# Altium schematic sheet Power.SchDoc
size A4; SheetNumber: 3; SheetTotal: 7
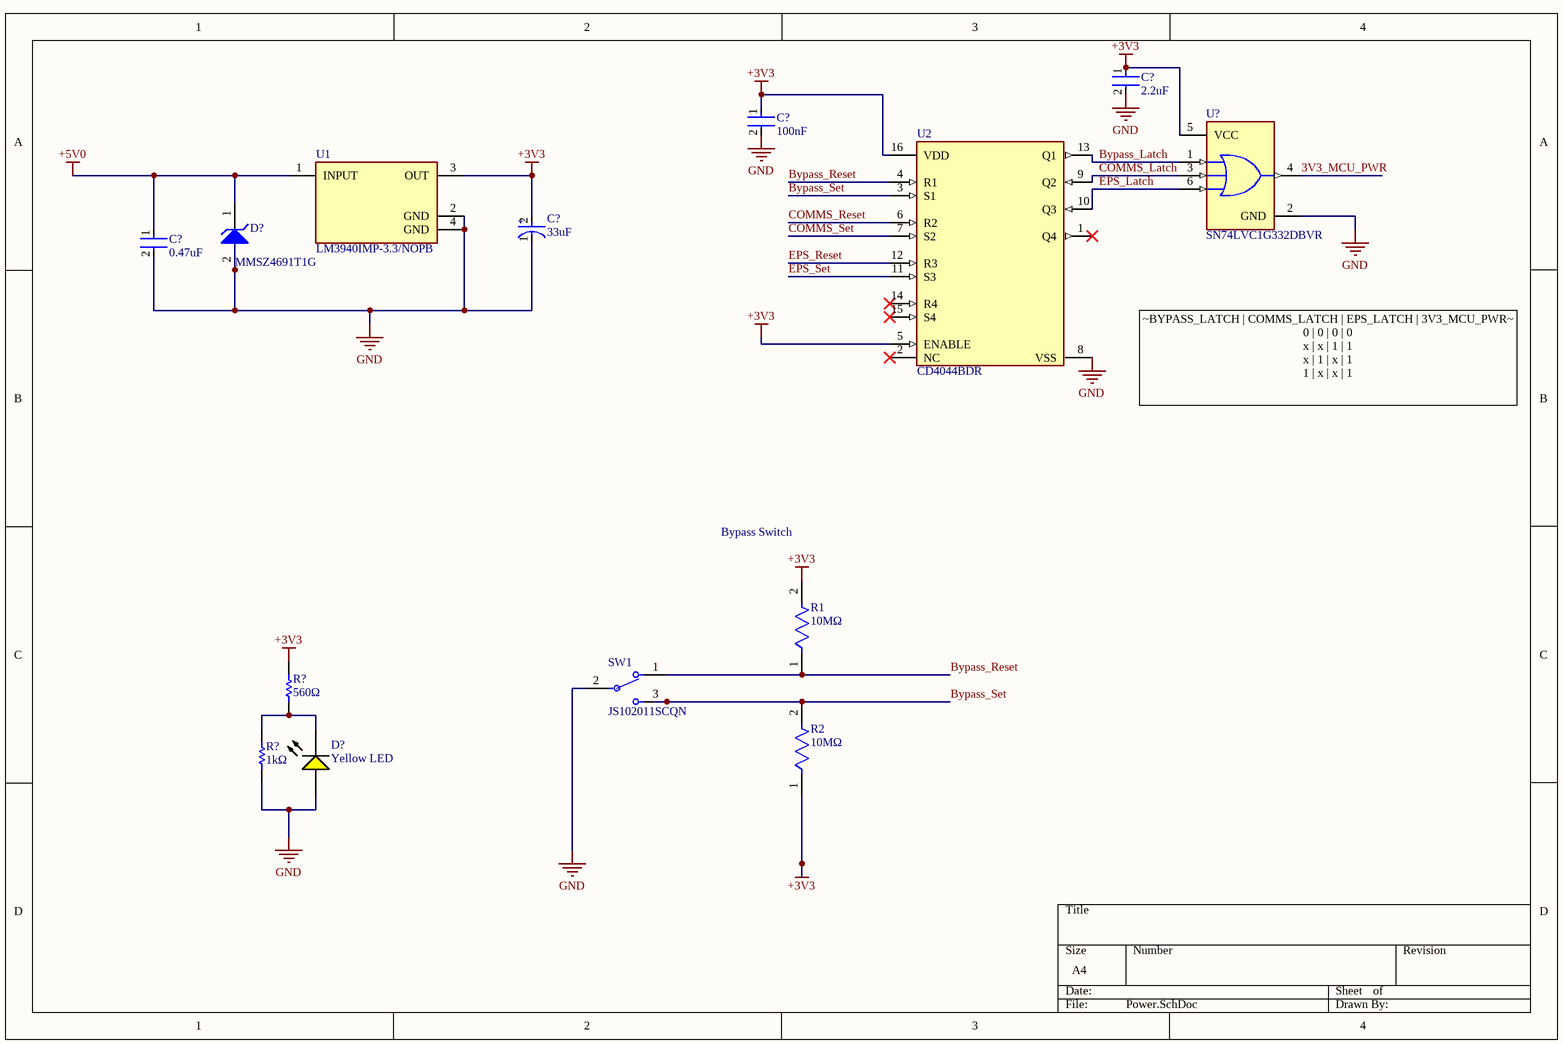
[diagram p0: Power.SchDoc]

## Parts
(Parts that share a designator on the sheet are numbered #1, #2 ... from top to bottom, then left to right.)
C?#1  2.2uF  [FP-GRM188-0_1-e0_2_0_5-MFG]
C?#2  100nF  [FP-CGA3E-0_3-0_1-IPC_A]
C?#3  33uF  [FP-TPSD-MFG]
C?#4  0.47uF  [FP-GRM188-0_1-e0_2_0_5-IPC_B]
D?#1  MMSZ4691T1G  [ONSC-SOD-123-2-425-04_V]
D?#2  Yellow LED  [AVAG-HSMX-C190_V]
R1  10MΩ  [FP-ERJ3EK-IPC_C]
R2  10MΩ  [FP-ERJ3EK-IPC_C]
R?#1  560Ω  [RESC1608X55X30ML15T15]
R?#2  1kΩ  [RESC2013X60X35ML10T20]
SW1  JS102011SCQN  [FP-JS102011SCQN-MFG]
U1  LM3940IMP-3.3/NOPB  [FP-DCY0004A-MFG]
U2  CD4044BDR  [FP-D0016A-IPC_C]
U?  SN74LVC1G332DBVR  [FP-DBV0006A-MFG]

## Nets
+3V3: C?#1.1 C?#2.1 C?#3.2(A) R1.2 R2.1 R?#1.2 U1.3(OUT) U2.5(ENABLE) U2.16(VDD) U?.5(VCC)
+5V0: C?#4.1 D?#1.1(K) U1.1(INPUT)
GND: C?#1.2 C?#2.2 C?#3.1(C) C?#4.2 D?#1.2(A) D?#2.1(A) R?#2.1 SW1.2(C) U1.2(GND) U1.4(GND) U2.8(VSS) U?.2(GND)
3V3_MCU_PWR: U?.4(Y)
Bypass_Latch: U2.13(Q1) U?.1(A)
Bypass_Reset: R1.1 SW1.1 U2.4(R1)
Bypass_Set: R2.2 SW1.3 U2.3(S1)
COMMS_Latch: U2.9(Q2) U?.3(B)
COMMS_Reset: U2.6(R2)
COMMS_Set: U2.7(S2)
EPS_Latch: U2.10(Q3) U?.6(C)
EPS_Reset: U2.12(R3)
EPS_Set: U2.11(S3)
NetD?#2_2: D?#2.2(K) R?#1.1 R?#2.2

Not connected (* = marked no-connect by the designer): U2 1(Q4)* 2(NC)* 14(R4)* 15(S4)*

## Notes on the sheet
- ~BYPASS_LATCH | COMMS_LATCH | EPS_LATCH | 3V3_MCU_PWR~
  0 | 0 | 0 | 0
  x | x | 1 | 1
  x | 1 | x | 1
  1 | x | x | 1
- Bypass Switch
- (in symbol CMP-2000-07304-2) +

## Library data of the parts
C?#1 = CMP-2006-02836-2: Chip Multilayer Ceramic Capacitors for General Purpose, 0603, 2.2uF, X7R, 15%, 10%, 10V; Case Code (Metric): 1608; Height: 0.8mm; Packaging: Cut Tape; Voltage: 10V; Lead Free: Lead Free; Min Operating Temperature: -55°C; Voltage Rating (DC): 10V; Max Operating Temperature: 125°C; Voltage Rating: 10V; Dielectric: X7R; Depth: 0.8mm; Case Code (Imperial): 0603; Termination: SMD/SMT; Case/Package: 0603; Number of Pins: 2; REACH SVHC: No SVHC; Mount: Surface Mount; Width: 0.031inch; Material: Ceramic; Capacitance: 2.2uF; Package Quantity: 1; Weight: 7.1E-05oz; Length: 1.6mm; Thickness: 0.035inch; Tolerance: 10%
C?#2 = CMP-2000-07546-2: Cap Ceramic 100nF 50V X7R 10% Pad SMD 0603 +125°C Automotive T/R; Weight: 7.1E-05oz; Composition: Ceramic; Max Operating Temperature: 125°C; Termination: SMD/SMT; Dielectric: X7R; Length: 1.6mm; Package Quantity: 1; REACH SVHC: No SVHC; Lead Free: Lead Free; Case Code (Metric): 1608; Min Operating Temperature: -55°C; Packaging: Tape and Reel; Tolerance: 10%; Voltage Rating: 50V; Case Code (Imperial): 0603; Capacitance: 100nF; Case/Package: 0603; Voltage Rating (DC): 50V; Depth: 0.8mm; Radiation Hardening: No; Ratings: AEC-Q200; Mount: Surface Mount; Voltage: 50V; Thickness: 0.035inch; Width: 0.8mm; Height: 0.8mm
C?#3 = CMP-2000-07304-2: CAP TANT 33UF 10% 35V 2917; Leakage Current: 11.6uA; Polarity: Polar; Ripple Current: 283uA; Dielectric Material: Tantalum; Dissipation Factor: 6%; ESR (Equivalent Series Resistance): 300mR; Number of Pins: 2; Series: TPS; Features: General Purpose; Capacitance: 33uF; Voltage Rating: 35V; Case Code (Imperial): 2917; Voltage Rating (DC): 35V; Min Operating Temperature: -55°C; Termination: SMD/SMT; REACH SVHC: No SVHC; Tolerance: 10%; Height - Seated (Max): 0.122inch; Height: 2.9mm; Package Quantity: 1; Case Code (Metric): 7343; RoHS Compliant: Yes; Voltage: 35V; Mount: Surface Mount; Weight: 0.023634oz; Packaging: Tape and Reel; Construction: Flat; Lead Free: Lead Free; Size: 2.9mm; Depth: 4.3mm; Case/Package: 2917; Radiation Hardening: No; Max Operating Temperature: 125°C; Length: 7.3mm; Width: 4.3mm
C?#4 = CMP-2006-02860-2: Chip Multilayer Ceramic Capacitors for General Purpose, 0603, 0.47uF, X7R, 15%, 10%, 16V; Capacitance: 470nF; Material: Ceramic; Termination: SMD/SMT; Case Code (Imperial): 0603; Height: 0.8mm; Dielectric: X7R; Length: 1.6mm; Packaging: Tape and Reel; Mount: Surface Mount; Thickness: 0.035inch; Voltage Rating (DC): 16V; Case Code (Metric): 1608; REACH SVHC: No SVHC; Depth: 0.8mm; Number of Pins: 2; Max Operating Temperature: 125°C; Min Operating Temperature: -55°C; Width: 0.8mm; Voltage: 16V; Lead Free: Lead Free; Voltage Rating: 16V; Package Quantity: 1; Case/Package: 0603; Tolerance: 10%
D?#1 = CMP-1060-00606-1: Zener Voltage Regulator, 500 mW, 2-Pin SOD-123, Pb-Free, Tape and Reel; Manufacturer: On Semiconductor; VZ Typ (V): 6.2; P Max (W): 0.5; DatasheetVersion: Rev. 9; ComponentLink1Description: Manufacturer URL; PackageReference: SOD-123-2-425-04; PartNumber: MMSZ4691T1G; RoHS: Pb-Free; Mounting Technology: Surface Mount; ComponentLink3URL: http://www.onsemi.com/pub_link/Collateral/425-04.PDF; Packing: Tape and Reel; ComponentLink2URL: http://www.onsemi.com/pub_link/Collateral/MMSZ4678T1-D.PDF; PackageVersion: Rev. G, 10/2009; ComponentLink1URL: http://www.onsemi.com/; PackageDescription: 2-Pin SOD, Body 1.6 x 2.69 mm; ComponentLink2Description: Datasheet; ComponentLink3Description: Package Specification
D?#2 = CMP-1744-00003-1: LED Uni-Color Yellow, 65 mW, 20 mA, -40 to 85 degC, 2-Pin SMD, RoHS, Tape and Reel; Tolerance: 1%; Voltage Rating: 50 V; Power Rating: 100 mW; Case\Package: 0603; Resistance: 390 Ohm; Min Operating Temperature: -55 degC; Length: 1.6 mm; ComponentLink3Description: Package Specification; Mount: Surface Mount; PackageReference: HSMX-C190; ComponentLink2Description: Datasheet; DatasheetVersion: Mar-12; Case Code (Metric): 1608; Pins: 2; Package Quantity: 5000; ComponentLink2URL: http://docs.avagotech.com/docs/AV02-0551EN; ComponentLink1Description: Manufacturer URL; RoHSCompliant: true; Packaging: Tape and Reel; PackageDescription: 2-Pin Surface Mount Device, Body 1.6 x 0.8 mm, Height 0.9 mm; REACH SVHC: No SVHC; ComponentLink3URL: http://www.fairchildsemi.com/dwg/MA/MA03D.pdf; Voltage Rating (DC): 50 V; Width: 0.8 mm; ComponentLink1URL: http://www.avagotech.com/; Max Operating Temperature: 155 degC; Case Code (Imperial): 0603; Height: 0.45 mm
R1 R2 = CMP-1012-00849-3: RES SMD 1M OHM 1% 1/10W 0603; Resistance: 1MR; Voltage Rating: 75V; Temperature Coefficient: 100ppm/°C; Power Rating: 100mW; REACH SVHC: No SVHC; Radiation Hardening: No; Features: Automotive AEC-Q200; Case Code (Metric): 1608; Resistance Tolerance: 1%; Case/Package: 0603; Termination: SMD/SMT; Max Operating Temperature: 155°C; Tolerance: 1%; Size Code: 0603; Case Code (Imperial): 0603; Min Operating Temperature: -55°C; Number of Pins: 2; Mount: Surface Mount; Package Quantity: 1; Military Standard: Not; Voltage Rating (DC): 75V; Depth: 0.8mm; Packaging: Tape and Reel; Width: 0.8mm; Number of Terminations: 2; Length: 1.6mm; Height: 0.022inch; RoHS Compliant: Yes; Resistor Type: Thick Film; Contact Plating: Tin; Lead Free: Lead Free; Series: ERJ; Construction: Rectangular; Max Power Dissipation: 100mW
R?#1 = CMP-2000-00564-2: Chip Resistor, 560 Ohm, +/- 1%, 0.1 W, -55 to 155 degC, 0603 (1608 Metric), RoHS, Tape and Reel; Output Current: 2 A; Max Supply Voltage: 5 V; Min Supply Voltage: 3 V; Output Voltage: 35 V; Case\Package: QFN; Outputs: 1; PackageDescription: 2-Pin Surface Mount Device, Body 1.6 x 0.85 mm; ComponentLink1Description: Manufacturer URL; ComponentLink1URL: http://www.panasonic.com/; ComponentLink2Description: Datasheet; Package Quantity: 1500; DatasheetVersion: Apr-15; Min Operating Temperature: -20 degC; PackageReference: 0603; RoHSCompliant: true; Packaging: Tape and Reel; ComponentLink2URL: http://industrial.panasonic.com/cdbs/www-data/pdf/RDA0000/AOA0000C86.pdf; Radiation Hardening: No; REACH SVHC: No SVHC; Mount: Surface Mount; Max Operating Temperature: 85 degC; Pins: 28
R?#2 = CMP-2100-03671-1: Chip Resistor, 1 KOhm, +/- 1%, 125 mW, -55 to 155 degC, 0805 (2012 Metric), RoHS, Tape and Reel; Manufacturer: Yageo; Temperature Coefficient: 100ppm/degreesC; Voltage Rating (DC): 150V; Max Power Dissipation: 125mW; Resistance: 1KOhm; Number of Pins: 2; Number of Terminations: 2; Datasheet URL: http://www.yageo.com/NewPortal/yageodocoutput?fileName=/pdf/R-Chip/PYu-RC_Group_51_RoHS_L_5.pdf; Length: 0.079inch; Package Description: 2-Pin Surface Mounted Device, Body 2 x 1.25 mm; Depth: 1.25mm; Height: 0.024inch; Military Standard: Not; Case/Package: 0805; Package Reference: 0805; RoHSCompliant: true; Lead Free: LeadFree; Packaging: TapeandReel; Package Quantity: 1; Datasheet Version: Rev. 5, 10/2016; Tolerance: 1%; Min Operating Temperature: -55degC; Voltage Rating: 150V; Composition: ThickFilm; Case Code (Imperial): 0805; Power Rating: 125mW; Width: 0.049inch; Case Code (Metric): 2012; Manufacturer URL: http://www.yageo.com/; Max Operating Temperature: 155degC; REACH SVHC: Unknown; Termination: SMD/SMT
SW1 = CMP-10038-000023-1: SWITCH SLIDE SPDT 300MA 6V; Electrical Life: 5000Cycles; Actuator Type: Standard; Contact Resistance: 70mR; Actuator Material: Nylon; Max Voltage Rating (DC): 30V; Actuator Length: 2mm; Switch Function: On-On; Actuator Color: Black; Radiation Hardening: No; Throw Configuration: SPDT; Depth: 7.5mm; Case/Package: SMD/SMT; Package Quantity: 4000; Min Operating Temperature: -40°C; Length: 8.5mm; Current Rating: 300mA; Mount: Surface Mount; Voltage Rating (DC): 6V; RoHS Compliant: Yes; Orientation: Straight; Housing Material: Nylon; Contact Plating: Silver; Max Operating Temperature: 85°C; Packaging: Tape and Reel; Switch Travel: 2mm; Max Current Rating: 300mA; Contact Material: Copper Alloy; Series: JS; Termination: Gull Wing
U1 = CMP-0062-01788-4: IC REG LINEAR 3.3V 1A SOT223-4; Min Input Voltage: 4.5V; Max Supply Voltage: 7.5V; Number of Outputs: 1; Output Type: Fixed; Polarity: Positive; Dropout Voltage: 500mV; Quiescent Current: 15mA; Max Output Voltage: 3.3V; Length: 6.5mm; Termination: SMD/SMT; Width: 3.56mm; Min Supply Voltage: 4.5V; Max Output Current: 1A; Case/Package: SOT-223; Output Voltage: 3.3V; Current Rating: 1A; Packaging: Tape and Reel; Lead Free: Lead Free; Nominal Output Voltage: 3.3V; Height: 1.6mm; Series: -; Output Configuration: Positive; Radiation Hardening: No; Number of Regulators: 1; Package Quantity: 1000; REACH SVHC: No SVHC; Max Input Voltage: 7.5V; Max Operating Temperature: 125°C; Min Operating Temperature: -40°C; Output Current: 1A; Contact Plating: Tin; Number of Pins: 4; Mount: Surface Mount
U2 = CMP-04902-000018-1: IC QUAD NAND R/S LATCH 16SOIC; Polarity: Non-Inverting; Min Supply Voltage: 3V; Number of Output Lines: 4; Output Type: 3-STATE; Max Supply Voltage: 18V; Turn-On Delay Time: 50ns; Number of Elements: 1; Number of Input Lines: 8; Output Current: 6.8mA; High Level Output Current: -4.2mA; Low Level Output Current: 4.2mA; Quiescent Current: 20uA; Propagation Delay: 300ns; Mount: Surface Mount; Packaging: Tape and Reel; Weight: 0.004998oz; Contact Plating: Gold; Independent Circuits: 4; Number of Pins: 16; Number of Bits: 4; Max Operating Temperature: 125°C; Radiation Hardening: No; Case/Package: SOIC; Number of Circuits: 1; Technology: CMOS; Min Operating Temperature: -55°C; Package Quantity: 1; Lead Free: Lead Free; RoHS Compliant: Yes; Logic Function: Latch; Series: 4000B
U? = CMP-0859-00188-4: IC GATE OR 1CH 3-INP SOT23-6; Manufacturer: TEXAS INSTRUMENTS; Number Of Inputs: 3; Nominal Supply Current: 10-500uA; Number Of Circuits: 1; Max Supply Voltage: 5.5V; Standoff Height: 0mm; Propagation Delay: 4.5ns; Min Supply Voltage: 1.5V; Height: 1.45mm; Temperature Range High: +125°C; Device Class L3: Logic Gates; Device Class L2: Logic ICs; Lead Free: Yes; Temperature Range Low: -40°C; ComponentLink2URL: http://www.ti.com/lit/ds/symlink/sn74lvc1g332.pdf; Package: DBV0006A; ComponentLink2Description: Datasheet; Octopart: https://octopart.com/sn74lvc1g332dbvr-texas+instruments-464996; Category: IC; Automotive: No; Manufacturer Part Number: SN74LVC1G332DBVR; Ipc Land Pattern Name: SOT95P280X145-6; Logic Function Desc: OR; Ambient Temperature Range Low: -40°C; Temperature: -40°C to +125°C; Number Of Outputs: 1; Mouser Description: Logic Gates Sngl 3 Inpt + OR Gt; RoHS: TRUE; Ambient Temperature Range High: +125°C; Device Class L1: Integrated Circuits (ICs); Digikey Description: IC GATE OR 1CH 3-INP SOT23-6